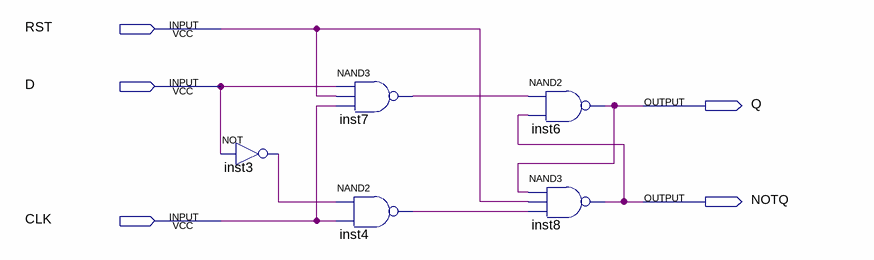
[diagram p0: schematic sheet]
// Quartus schematic LATCHD.bdf as structural Verilog: 5 symbols, 5 pins
module LATCHD (
  input  RST,
  input  D,
  input  CLK,
  output Q,
  output NOTQ
);

  wire inst3_out, inst4_out, inst7_out;

  not inst3 (inst3_out, D);
  nand inst7 (inst7_out, D, RST, CLK);
  nand inst4 (inst4_out, inst3_out, CLK);
  nand inst6 (Q, inst7_out, NOTQ);
  nand inst8 (NOTQ, Q, RST, inst4_out);
endmodule
